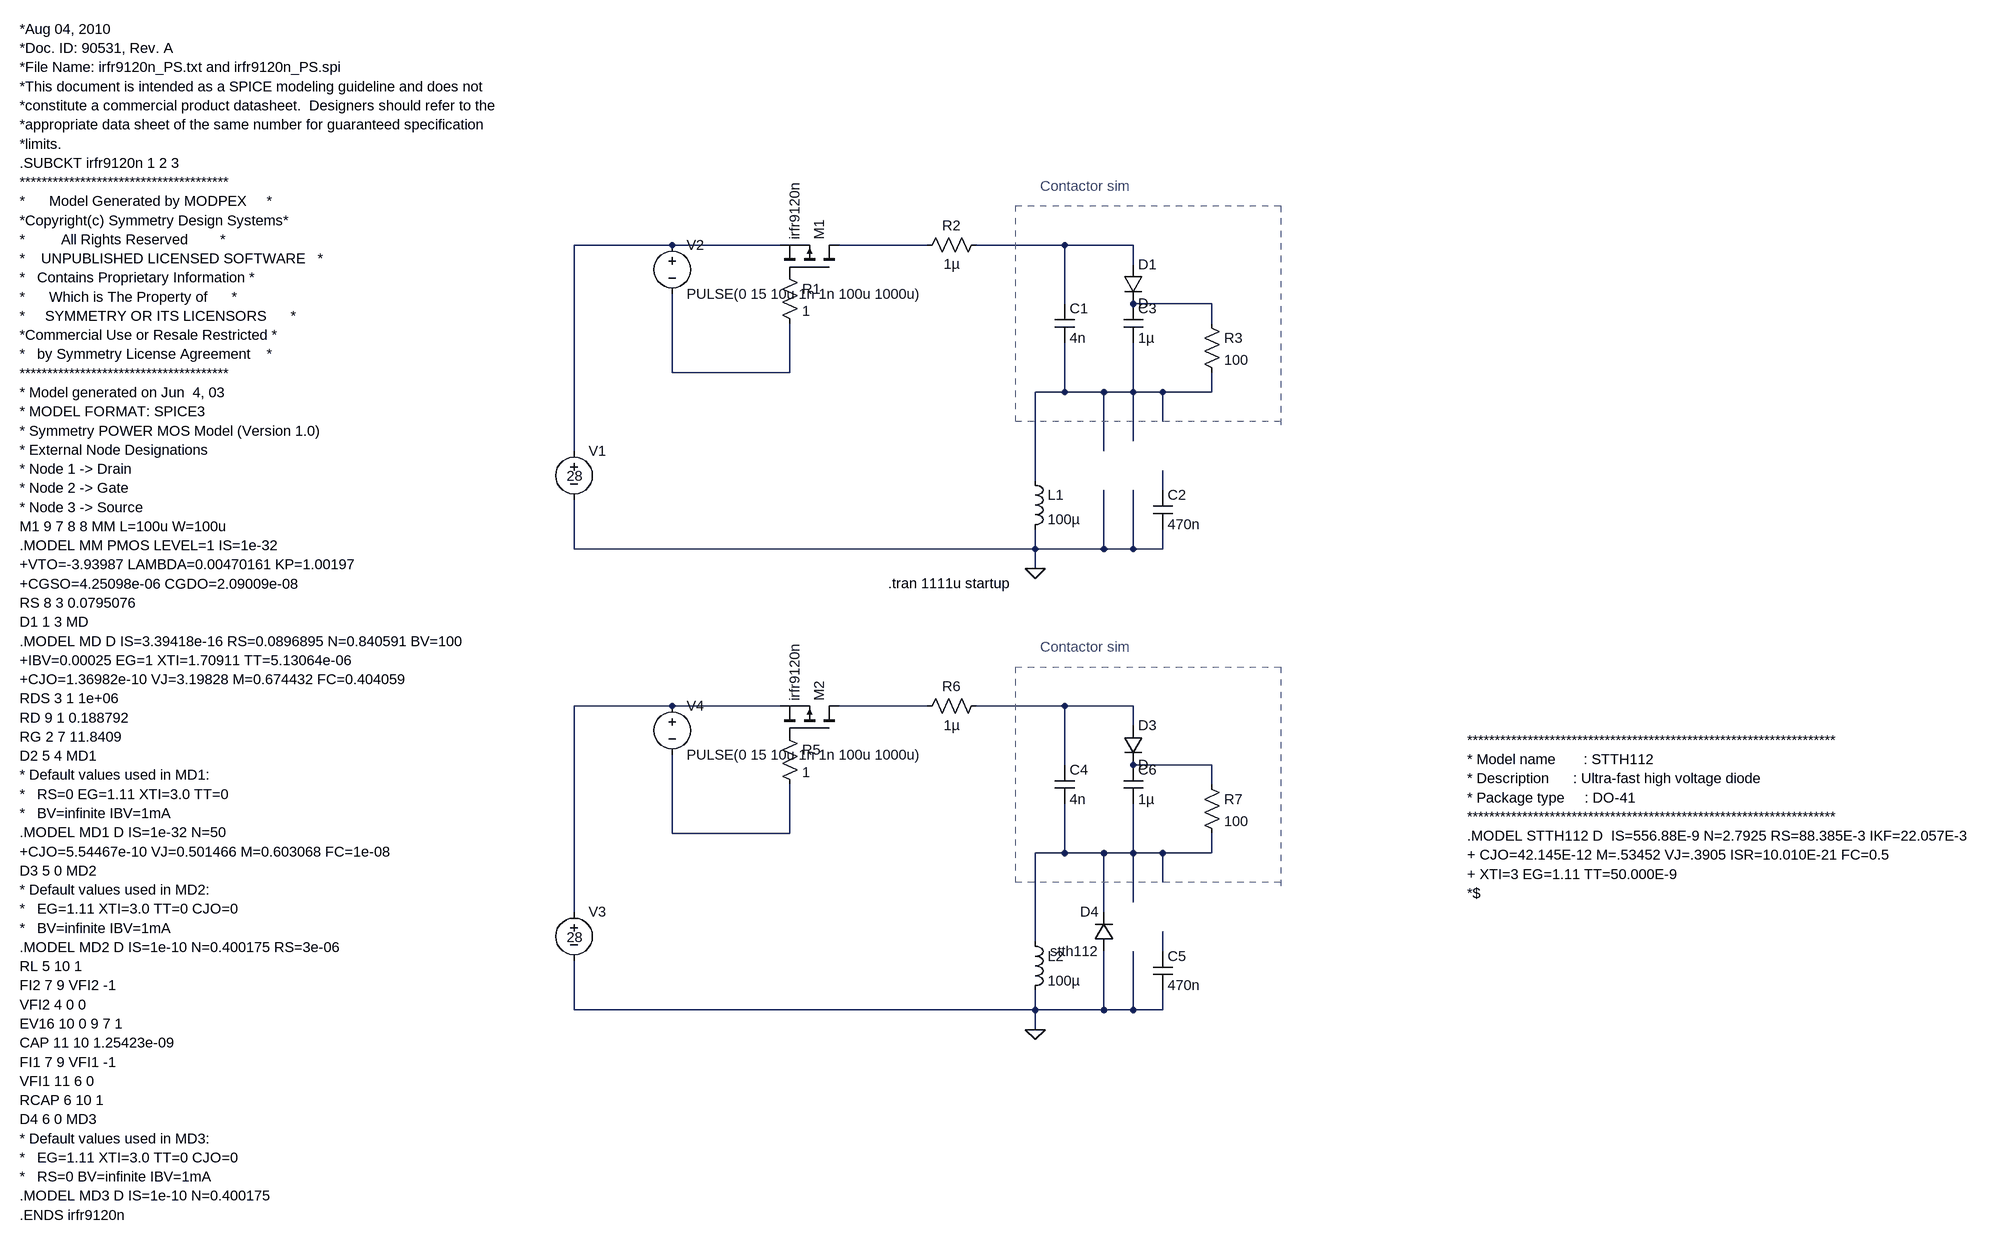
[diagram p0: schematic con driv.asc]
con driv.asc, the LTspice schematic file:
Version 4
SHEET 1 1960 1288
WIRE -320 -112 -480 -112
WIRE -144 -112 -320 -112
WIRE 96 -112 -48 -112
WIRE 320 -112 176 -112
WIRE 432 -112 320 -112
WIRE 432 -80 432 -112
WIRE 320 -16 320 -112
WIRE 560 -16 432 -16
WIRE 560 16 560 -16
WIRE -320 96 -320 -32
WIRE -128 96 -128 16
WIRE -128 96 -320 96
WIRE 320 128 320 48
WIRE 320 128 272 128
WIRE 384 128 320 128
WIRE 432 128 432 48
WIRE 432 128 384 128
WIRE 480 128 432 128
WIRE 560 128 560 96
WIRE 560 128 480 128
WIRE 480 176 480 128
WIRE 432 208 432 128
WIRE -480 224 -480 -112
WIRE 384 224 384 128
WIRE 272 272 272 128
WIRE 480 288 480 256
WIRE -480 384 -480 304
WIRE 272 384 272 352
WIRE 272 384 -480 384
WIRE 384 384 384 288
WIRE 384 384 272 384
WIRE 432 384 432 288
WIRE 432 384 384 384
WIRE 480 384 480 352
WIRE 480 384 432 384
WIRE 272 416 272 384
WIRE -320 640 -480 640
WIRE -144 640 -320 640
WIRE 96 640 -48 640
WIRE 320 640 176 640
WIRE 432 640 320 640
WIRE 432 672 432 640
WIRE 320 736 320 640
WIRE 560 736 432 736
WIRE 560 768 560 736
WIRE -320 848 -320 720
WIRE -128 848 -128 768
WIRE -128 848 -320 848
WIRE 320 880 320 800
WIRE 320 880 272 880
WIRE 384 880 320 880
WIRE 432 880 432 800
WIRE 432 880 384 880
WIRE 480 880 432 880
WIRE 560 880 560 848
WIRE 560 880 480 880
WIRE 480 928 480 880
WIRE 432 960 432 880
WIRE -480 976 -480 640
WIRE 384 976 384 880
WIRE 272 1024 272 880
WIRE 480 1040 480 1008
WIRE -480 1136 -480 1056
WIRE 272 1136 272 1104
WIRE 272 1136 -480 1136
WIRE 384 1136 384 1040
WIRE 384 1136 272 1136
WIRE 432 1136 432 1040
WIRE 432 1136 384 1136
WIRE 480 1136 480 1104
WIRE 480 1136 432 1136
WIRE 272 1168 272 1136
FLAG 272 1168 0
FLAG 272 416 0
SYMBOL voltage -480 960 R0
WINDOW 3 -12 57 Left 2
WINDOW 123 0 0 Left 0
WINDOW 39 0 0 Left 0
SYMATTR Value 28
SYMATTR InstName V3
SYMBOL cap 304 736 R0
SYMATTR InstName C4
SYMATTR Value 4n
SYMATTR SpiceLine Rser=1
SYMBOL ind 256 1008 R0
SYMATTR InstName L2
SYMATTR Value 100µ
SYMATTR SpiceLine Rser=290m
SYMBOL cap 464 1040 R0
SYMATTR InstName C5
SYMATTR Value 470n
SYMBOL pmos -48 688 M270
SYMATTR InstName M2
SYMATTR Value irfr9120n
SYMATTR Prefix x
SYMBOL voltage -320 624 R0
WINDOW 123 0 0 Left 0
WINDOW 39 0 0 Left 0
SYMATTR InstName V4
SYMATTR Value PULSE(0 15 10u 1n 1n 100u 1000u)
SYMBOL res -144 672 R0
SYMATTR InstName R5
SYMATTR Value 1
SYMBOL cap 416 736 R0
SYMATTR InstName C6
SYMATTR Value 1µ
SYMBOL diode 416 672 R0
SYMATTR InstName D3
SYMBOL res 80 656 R270
WINDOW 0 32 56 VTop 2
WINDOW 3 0 56 VBottom 2
SYMATTR InstName R6
SYMATTR Value 1µ
SYMBOL diode 400 1040 R180
WINDOW 0 24 64 Left 2
WINDOW 3 24 0 Left 2
SYMATTR InstName D4
SYMATTR Value stth112
SYMBOL res 544 752 R0
SYMATTR InstName R7
SYMATTR Value 100
SYMBOL voltage -480 208 R0
WINDOW 3 -12 57 Left 2
WINDOW 123 0 0 Left 0
WINDOW 39 0 0 Left 0
SYMATTR Value 28
SYMATTR InstName V1
SYMBOL cap 304 -16 R0
SYMATTR InstName C1
SYMATTR Value 4n
SYMATTR SpiceLine Rser=1
SYMBOL ind 256 256 R0
SYMATTR InstName L1
SYMATTR Value 100µ
SYMATTR SpiceLine Rser=290m
SYMBOL cap 464 288 R0
SYMATTR InstName C2
SYMATTR Value 470n
SYMBOL pmos -48 -64 M270
SYMATTR InstName M1
SYMATTR Value irfr9120n
SYMATTR Prefix x
SYMBOL voltage -320 -128 R0
WINDOW 123 0 0 Left 0
WINDOW 39 0 0 Left 0
SYMATTR InstName V2
SYMATTR Value PULSE(0 15 10u 1n 1n 100u 1000u)
SYMBOL res -144 -80 R0
SYMATTR InstName R1
SYMATTR Value 1
SYMBOL cap 416 -16 R0
SYMATTR InstName C3
SYMATTR Value 1µ
SYMBOL diode 416 -80 R0
SYMATTR InstName D1
SYMBOL res 80 -96 R270
WINDOW 0 32 56 VTop 2
WINDOW 3 0 56 VBottom 2
SYMATTR InstName R2
SYMATTR Value 1µ
SYMBOL res 544 0 R0
SYMATTR InstName R3
SYMATTR Value 100
TEXT -1384 -464 Left 2 !*Aug 04, 2010\n*Doc. ID: 90531, Rev. A\n*File Name: irfr9120n_PS.txt and irfr9120n_PS.spi\n*This document is intended as a SPICE modeling guideline and does not\n*constitute a commercial product datasheet.  Designers should refer to the\n*appropriate data sheet of the same number for guaranteed specification\n*limits.\n.SUBCKT irfr9120n 1 2 3\n**************************************\n*      Model Generated by MODPEX     *\n*Copyright(c) Symmetry Design Systems*\n*         All Rights Reserved        *\n*    UNPUBLISHED LICENSED SOFTWARE   *\n*   Contains Proprietary Information *\n*      Which is The Property of      *\n*     SYMMETRY OR ITS LICENSORS      *\n*Commercial Use or Resale Restricted *\n*   by Symmetry License Agreement    *\n**************************************\n* Model generated on Jun  4, 03\n* MODEL FORMAT: SPICE3\n* Symmetry POWER MOS Model (Version 1.0)\n* External Node Designations\n* Node 1 -> Drain\n* Node 2 -> Gate\n* Node 3 -> Source\nM1 9 7 8 8 MM L=100u W=100u\n.MODEL MM PMOS LEVEL=1 IS=1e-32\n+VTO=-3.93987 LAMBDA=0.00470161 KP=1.00197\n+CGSO=4.25098e-06 CGDO=2.09009e-08\nRS 8 3 0.0795076\nD1 1 3 MD\n.MODEL MD D IS=3.39418e-16 RS=0.0896895 N=0.840591 BV=100\n+IBV=0.00025 EG=1 XTI=1.70911 TT=5.13064e-06\n+CJO=1.36982e-10 VJ=3.19828 M=0.674432 FC=0.404059\nRDS 3 1 1e+06\nRD 9 1 0.188792\nRG 2 7 11.8409\nD2 5 4 MD1\n* Default values used in MD1:\n*   RS=0 EG=1.11 XTI=3.0 TT=0\n*   BV=infinite IBV=1mA\n.MODEL MD1 D IS=1e-32 N=50\n+CJO=5.54467e-10 VJ=0.501466 M=0.603068 FC=1e-08\nD3 5 0 MD2\n* Default values used in MD2:\n*   EG=1.11 XTI=3.0 TT=0 CJO=0\n*   BV=infinite IBV=1mA\n.MODEL MD2 D IS=1e-10 N=0.400175 RS=3e-06\nRL 5 10 1\nFI2 7 9 VFI2 -1\nVFI2 4 0 0\nEV16 10 0 9 7 1\nCAP 11 10 1.25423e-09\nFI1 7 9 VFI1 -1\nVFI1 11 6 0\nRCAP 6 10 1\nD4 6 0 MD3\n* Default values used in MD3:\n*   EG=1.11 XTI=3.0 TT=0 CJO=0\n*   RS=0 BV=infinite IBV=1mA\n.MODEL MD3 D IS=1e-10 N=0.400175\n.ENDS irfr9120n
TEXT 280 544 Left 2 ;Contactor sim
TEXT 976 696 Left 2 !*******************************************************************\n* Model name       : STTH112\n* Description      : Ultra-fast high voltage diode\n* Package type     : DO-41\n*******************************************************************\n.MODEL STTH112 D  IS=556.88E-9 N=2.7925 RS=88.385E-3 IKF=22.057E-3\n+ CJO=42.145E-12 M=.53452 VJ=.3905 ISR=10.010E-21 FC=0.5 \n+ XTI=3 EG=1.11 TT=50.000E-9\n*$
TEXT 32 440 Left 2 !.tran 1111u startup
TEXT 280 -208 Left 2 ;Contactor sim
LINE Normal 240 928 240 576 2
LINE Normal 672 928 240 928 2
LINE Normal 672 576 672 944 2
LINE Normal 240 576 672 576 2
LINE Normal 240 176 240 -176 2
LINE Normal 672 176 240 176 2
LINE Normal 672 -176 672 192 2
LINE Normal 240 -176 672 -176 2

The netlist it stands for:
* con driv.asc
V3 N008 0 28
C4 N010 N013 4n Rser=1
L2 N013 0 100µ Rser=290m
C5 N014 0 470n
XM2 N009 P001 N008 irfr9120n  ; pins D G S
V4 N008 N012 PULSE(0 15 10u 1n 1n 100u 1000u)
R5 P001 N012 1
C6 N011 N013 1µ
D3 N010 N011 D
R6 N009 N010 1µ
D4 0 N013 stth112
R7 N011 N013 100
V1 N001 0 28
C1 N003 N006 4n Rser=1
L1 N006 0 100µ Rser=290m
C2 N007 0 470n
XM1 N002 P002 N001 irfr9120n  ; pins D G S
V2 N001 N005 PULSE(0 15 10u 1n 1n 100u 1000u)
R1 P002 N005 1
C3 N004 N006 1µ
D1 N003 N004 D
R2 N002 N003 1µ
R3 N004 N006 100
.model D D
.lib standard.dio
*Aug 04, 2010
*Doc. ID: 90531, Rev. A
*File Name: irfr9120n_PS.txt and irfr9120n_PS.spi
*This document is intended as a SPICE modeling guideline and does not
*constitute a commercial product datasheet.  Designers should refer to the
*appropriate data sheet of the same number for guaranteed specification
*limits.
.SUBCKT irfr9120n 1 2 3
**************************************
*      Model Generated by MODPEX     *
*Copyright(c) Symmetry Design Systems*
*         All Rights Reserved        *
*    UNPUBLISHED LICENSED SOFTWARE   *
*   Contains Proprietary Information *
*      Which is The Property of      *
*     SYMMETRY OR ITS LICENSORS      *
*Commercial Use or Resale Restricted *
*   by Symmetry License Agreement    *
**************************************
* Model generated on Jun  4, 03
* MODEL FORMAT: SPICE3
* Symmetry POWER MOS Model (Version 1.0)
* External Node Designations
* Node 1 -> Drain
* Node 2 -> Gate
* Node 3 -> Source
M1 9 7 8 8 MM L=100u W=100u
.MODEL MM PMOS LEVEL=1 IS=1e-32
+VTO=-3.93987 LAMBDA=0.00470161 KP=1.00197
+CGSO=4.25098e-06 CGDO=2.09009e-08
RS 8 3 0.0795076
D1 1 3 MD
.MODEL MD D IS=3.39418e-16 RS=0.0896895 N=0.840591 BV=100
+IBV=0.00025 EG=1 XTI=1.70911 TT=5.13064e-06
+CJO=1.36982e-10 VJ=3.19828 M=0.674432 FC=0.404059
RDS 3 1 1e+06
RD 9 1 0.188792
RG 2 7 11.8409
D2 5 4 MD1
* Default values used in MD1:
*   RS=0 EG=1.11 XTI=3.0 TT=0
*   BV=infinite IBV=1mA
.MODEL MD1 D IS=1e-32 N=50
+CJO=5.54467e-10 VJ=0.501466 M=0.603068 FC=1e-08
D3 5 0 MD2
* Default values used in MD2:
*   EG=1.11 XTI=3.0 TT=0 CJO=0
*   BV=infinite IBV=1mA
.MODEL MD2 D IS=1e-10 N=0.400175 RS=3e-06
RL 5 10 1
FI2 7 9 VFI2 -1
VFI2 4 0 0
EV16 10 0 9 7 1
CAP 11 10 1.25423e-09
FI1 7 9 VFI1 -1
VFI1 11 6 0
RCAP 6 10 1
D4 6 0 MD3
* Default values used in MD3:
*   EG=1.11 XTI=3.0 TT=0 CJO=0
*   RS=0 BV=infinite IBV=1mA
.MODEL MD3 D IS=1e-10 N=0.400175
.ENDS irfr9120n
* Contactor sim
*******************************************************************
* Model name       : STTH112
* Description      : Ultra-fast high voltage diode
* Package type     : DO-41
*******************************************************************
.MODEL STTH112 D  IS=556.88E-9 N=2.7925 RS=88.385E-3 IKF=22.057E-3
+ CJO=42.145E-12 M=.53452 VJ=.3905 ISR=10.010E-21 FC=0.5
+ XTI=3 EG=1.11 TT=50.000E-9
*$
.tran 1111u startup
* Contactor sim
.backanno
.end